# EAGLE schematic lcd2 (EAGLE 4.16)
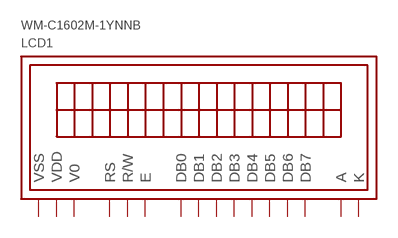
[diagram p0: schematic, sheet 1]

## Parts
LCD1  WM-C1602M-1YNNB  [LCD_2]
Unconnected: LCD1.1(VSS) LCD1.2(VDD) LCD1.3(V0) LCD1.4(RS) LCD1.5(R/W) LCD1.6(E) LCD1.7(DB0) LCD1.8(DB1) LCD1.9(DB2) LCD1.10(DB3) LCD1.11(DB4) LCD1.12(DB5) LCD1.13(DB6) LCD1.14(DB7) LCD1.15(A) LCD1.16(K)

## Library data of the parts
LCD1 = lcd:WM-C1602M-1YNNB: Display a cristalli liquidi tipo WM-C1602M WINTEK http://www..... Source: http://www.fairchildsemi.com/ds/ML/ML4425.pdf